# EAGLE design wanco_10V_PSUsch (EAGLE 7.6.0)
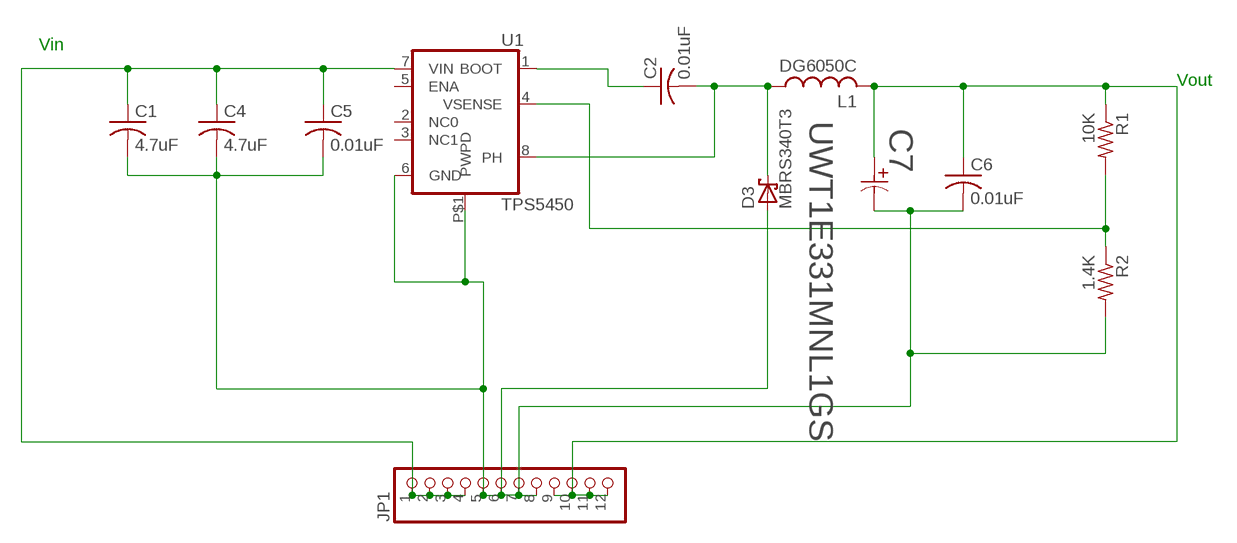
[diagram p0: schematic, sheet 1]

## Parts
C1  4.7uF  C-USC1206  [C1206]
C2  0.01uF  C-USC0805  [C0805]
C4  4.7uF  C-USC1206  [C1206]
C5  0.01uF  C-USC0805  [C0805]
C6  0.01uF  C-USC0805  [C0805]
C7  UWT1E331MNL1GS  [PCAP_8X10-ELECT]
D3  MBRS340T3  [SMC]
JP1  PINHD-1X12  [1X12]
L1  DG6050C  [DG]
R1  10K  R-US_R0805  [R0805]
R2  1.4K  R-US_R0805  [R0805]
U1  TPS5450  [SO08]

## Nets
BOOT [Power]: C2.1 U1.1(BOOT)
GND [Power]: C1.2 C4.2 C5.2 C6.2 C7.2 D3.A JP1.5 JP1.6 JP1.7 JP1.8 R2.2 U1.6(GND) U1.P$1(PWPD)
PH: C2.2 D3.C L1.P$1 U1.8(PH)
VIN [Power]: C1.1 C4.1 C5.1 JP1.1 JP1.2 JP1.3 JP1.4 U1.7(VIN)
VOUT [Power]: C6.1 C7.1 JP1.9 JP1.10 JP1.11 JP1.12 L1.P$2 R1.1
VSENSE: R1.2 R2.1 U1.4(VSENSE)
Unconnected: U1.2(NC0) U1.3(NC1) U1.5(ENA)

## Notes on the sheet
- Vin
- Vout

## Library data of the parts
C1 C4 = rcl:C-US: CAPACITOR, American symbol
C2 C5 C6 = resistor:C-US: CAPACITOR, American symbol
C7 = digikey:UWT1E331MNL1GS; COPYRIGHT: Copyright (C) 2015 Accelerated Designs. All rights reserved; MANUFACTURER_PART_NUMBER: UWT1E331MNL1GS; VENDOR: Nichicon
D3 = diode:MBRS3*0T3: SCHOTTKY BARRIER RECTIFIER 3.0 AMPERES 20, 30, 40 VOLT Source: MBRS340T3-D.pdf
JP1 = adafruit:PINHD-1X12: PIN HEADER
L1 = natrucha:DG6050C: DG8050C Wound ferrite, fixed inductor 15uH, 3A 104.4MOhm SMD from muRata Electronics http://www.toko.co.jp/products-murata/pdf/inductors/m_dg6050c.pdf
R1 R2 = rcl:R-US_: RESISTOR, American symbol
U1 = natrucha:TPS5450: TPS5450 Texas instrument high-output-current PWM converter that integrates a low-resistance, high-side N-channel MOSFET. Wide Input Voltage Range: 5.5 V to 36 V and up to 5-A Continuous (6-A Peak) Output Current. from http://www.ti.com/product/TPS5450/technicaldocuments

## Net classes
0 Signal: width 0.406 mm, drill 0.33 mm, clearance 0.381 mm
1 Power: width 2.083 mm, drill 0.33 mm, clearance 0.381 mm

## Board
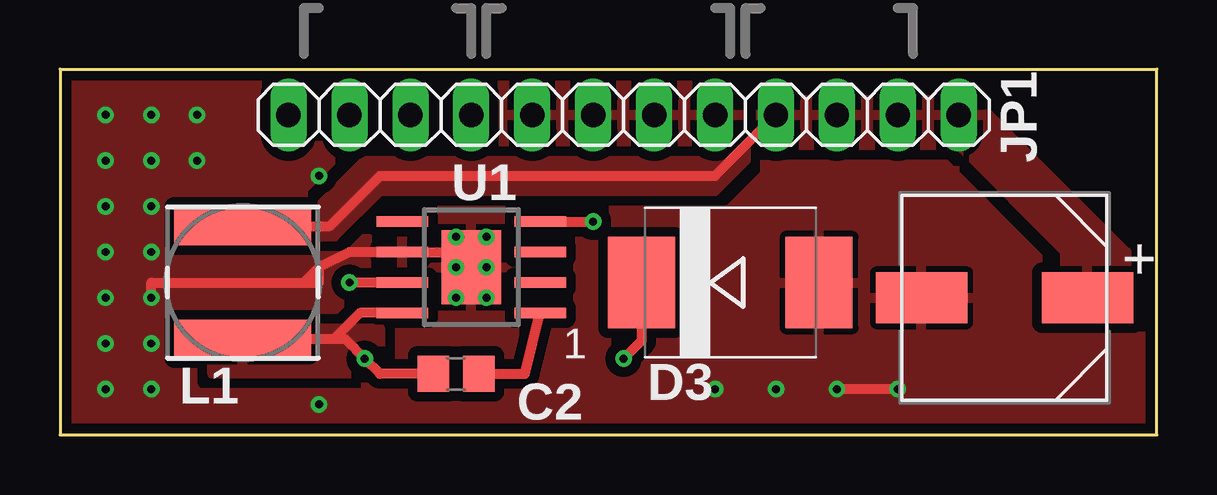
[diagram p1: board, top side]
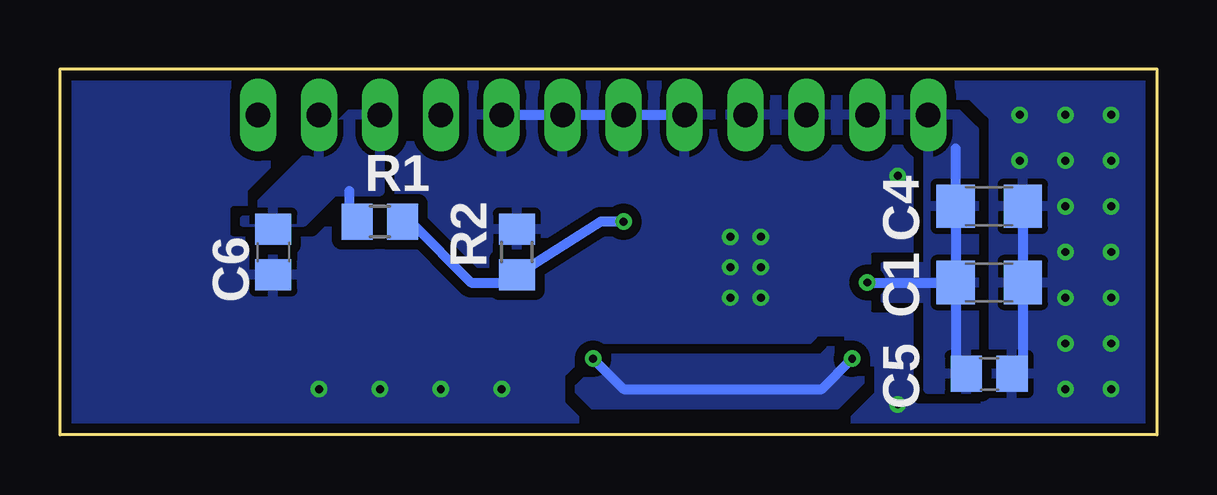
[diagram p2: board, bottom side, seen from below]

Size 45.72 x 15.24 mm. Coordinates in mm from the lower left corner, seen from the top.
Outline: 0,0 45.72,0 45.72,15.24 0,15.24 0,0
Copper layers (1*16): Top 0.0356mm / dielectric 1.5011mm / Bottom 0.0356mm
Design rules "oshpark-2layer": minimum track width 6mil, minimum drill 13mil, track to track 6mil, track to pad 6mil, pad to pad 6mil, via to via 6mil, smd to smd 6mil, copper to edge 15mil, drill to drill 6mil, minimum pad ring 7mil, minimum via ring 7mil, stop-mask expansion 2.5mil, vias tented up to drill 0mil, thermal gap 10mil

### Footprints (pad centres in the part's own frame; a part is rotated, then mirrored left to right if it is on the bottom)
C1206 = smd 1.6 x 1.8: 1 -1.4,0; 2 1.4,0
C0805 = smd 1.3 x 1.5: 1 -0.95,0; 2 0.95,0
PCAP_8X10-ELECT = smd 3.81 x 2.108: 1 -3.454,0; 2 3.454,0
SMC = smd 2.8 x 3.8: A 3.7,0; C -3.7,0
1X12 = drill 1.016 long: 1 -13.97,0; 2 -11.43,0; 3 -8.89,0; 4 -6.35,0; 5 -3.81,0; 6 -1.27,0; 7 1.27,0; 8 3.81,0; 9 6.35,0; 10 8.89,0; 11 11.43,0; 12 13.97,0
DG = smd 1.6 x 5.7: P$1 -2.35,0; P$2 2.35,0
R0805 = smd 1.3 x 1.5: 1 -0.95,0; 2 0.95,0
SO08 = smd 2.15 x 0.45: 1 2.875,-1.905; 2 2.875,-0.635; 3 2.875,0.635; 4 2.875,1.905; 5 -2.875,1.905; 6 -2.875,0.635; 7 -2.875,-0.635; 8 -2.875,-1.905 | smd 2.49 x 3.1: P$1 0,0

### Placement (x,y rotation side)
C1  6.99,6.35 0 bottom
C2  16.51,2.54 180 top
C4  6.99,9.53 0 bottom
C5  6.99,2.54 0 bottom
C6  36.83,7.62 270 bottom
C7  39.37,5.71 180 top
D3  27.94,6.35 0 top
JP1  23.5,13.34 0 top
L1  7.62,6.35 90 top
R1  32.38,8.89 0 bottom
R2  26.67,7.62 90 bottom
U1  17.14,6.99 0 top

### Tracks (layer width: path | path; a pad name or v marks a point on that pad's centre or on a via)
BOOT
  Top 0.406: C2.1 19.39,2.54 U1.1
GND  (via drill 0.33)
  Top 0.406: v34.92,1.91 v32.38,1.91 | v3.81,5.71 3.81,6.35 10.16,6.35 | 10.16,6.35 10.79,6.99 | 10.16,6.35 10.79,6.35 10.79,6.99 | 10.79,6.99 12.06,7.62 U1.6 16.51,7.62 v16.51,8.26 | U1.P$1 v17.78,6.99 v17.78,8.26
  Bottom 0.406: C4.2 C1.2 5.58,2.99 C5.2 | JP1.8 JP1.5
  other vias: 1.91,13.34 3.81,13.34 5.71,13.34 1.91,11.43 1.91,9.53 1.91,7.62 3.81,11.43 5.71,11.43 3.81,9.53 3.81,7.62 1.91,3.81 3.81,3.81 1.91,1.91 3.81,1.91 10.79,1.27 10.79,10.79 27.3,1.91 29.84,1.91 1.91,5.71 17.78,5.71 16.51,5.71 16.51,6.99
  pour Top (isolate 0.406): 32.38,5.08 34.92,5.08 34.92,8.89 33.02,10.79 29.84,10.79 29.84,9.53 31.75,9.53 32.38,8.89
  pour Bottom (isolate 0.406, rank 6): 0,15.24 45.72,15.24 45.72,0 0,0
  pour Top (isolate 0.406, rank 6): 0,15.24 45.72,15.24 45.72,0 0,0
N$9  (via drill 0.33)
  other vias: 22.23,8.89
N$23  (via drill 0.33)
  other vias: 23.5,3.17
N$24  (via drill 0.33)
  other vias: 12.7,3.17
N$26  (via drill 0.33)
  other vias: 12.06,6.35
PH  (via drill 0.33)
  Top 0.406: D3.C 24.24,3.92 v23.5,3.17 | L1.P$1 11.43,4 | 11.43,4 11.88,4 v12.7,3.17 13.34,2.54 C2.2 | U1.8 12.51,5.08 11.43,4
  Bottom 0.406: v23.5,3.17 22.23,1.91 13.97,1.91 v12.7,3.17
  pour Bottom (isolate 0.406): 22.86,3.17 24.13,1.91 23.5,1.27 13.34,1.27 12.06,2.54 13.34,3.81 13.97,3.17
  pour Top (isolate 0.406): 12.7,4.45 13.34,4.45 13.34,2.54 6.35,2.54 6.35,4.45
VIN  (via drill 0.33)
  Top 0.406: U1.7 v12.06,6.35
  Bottom 0.406: C1.1 C4.1 8.38,11.94 | C1.1 8.38,2.99 C5.1 | v12.06,6.35 C1.1
  pour Bottom (isolate 0.406): 11.43,6.99 11.43,5.71 7.62,5.71 7.62,6.99
  pour Bottom (isolate 0.406): 7.62,1.91 9.53,1.91 9.53,11.43 10.16,12.7 17.78,12.7 17.78,13.97 8.89,13.97 7.62,12.7
VOUT
  Top 0.406: L1.P$2 11.24,8.7 13.34,10.79 27.3,10.79 JP1.9
  Bottom 0.406: R1.1 33.66,8.57 33.66,10.16 | C6.1 36.83,8.89
  pour Top: 42.55,5.71 44.45,5.08 42.55,5.08
  pour Top (isolate 0.406): 29.21,13.97 38.1,13.97 44.45,7.62 44.45,5.71 41.91,5.71 41.91,7.62 37.47,12.06 29.84,12.06 29.21,12.7
  pour Top (isolate 0.406): 10.16,9.53 10.79,9.53 12.7,11.43 27.94,11.43 28.57,12.06 28.57,11.43 27.3,10.16 13.34,10.16 11.43,8.26 10.16,8.26
  pour Bottom (isolate 0.406): 38.1,8.89 36.2,8.89 35.56,8.89 34.29,10.16 32.38,10.16 32.38,13.97 33.02,13.97
VSENSE  (via drill 0.33)
  Top 0.406: U1.4 v22.23,8.89
  Bottom 0.406: R1.2 31.11,8.89 28.57,6.35 26.99,6.35 R2.1 23.18,8.89 v22.23,8.89

### Text on the board
tDocu: Vin | GND | Vout | Note: Maximum part height is 0.45" above top surface of PCB.